# EAGLE design Volterra Doughter Board MKS GEN L 2.1 (EAGLE 9.6.2)
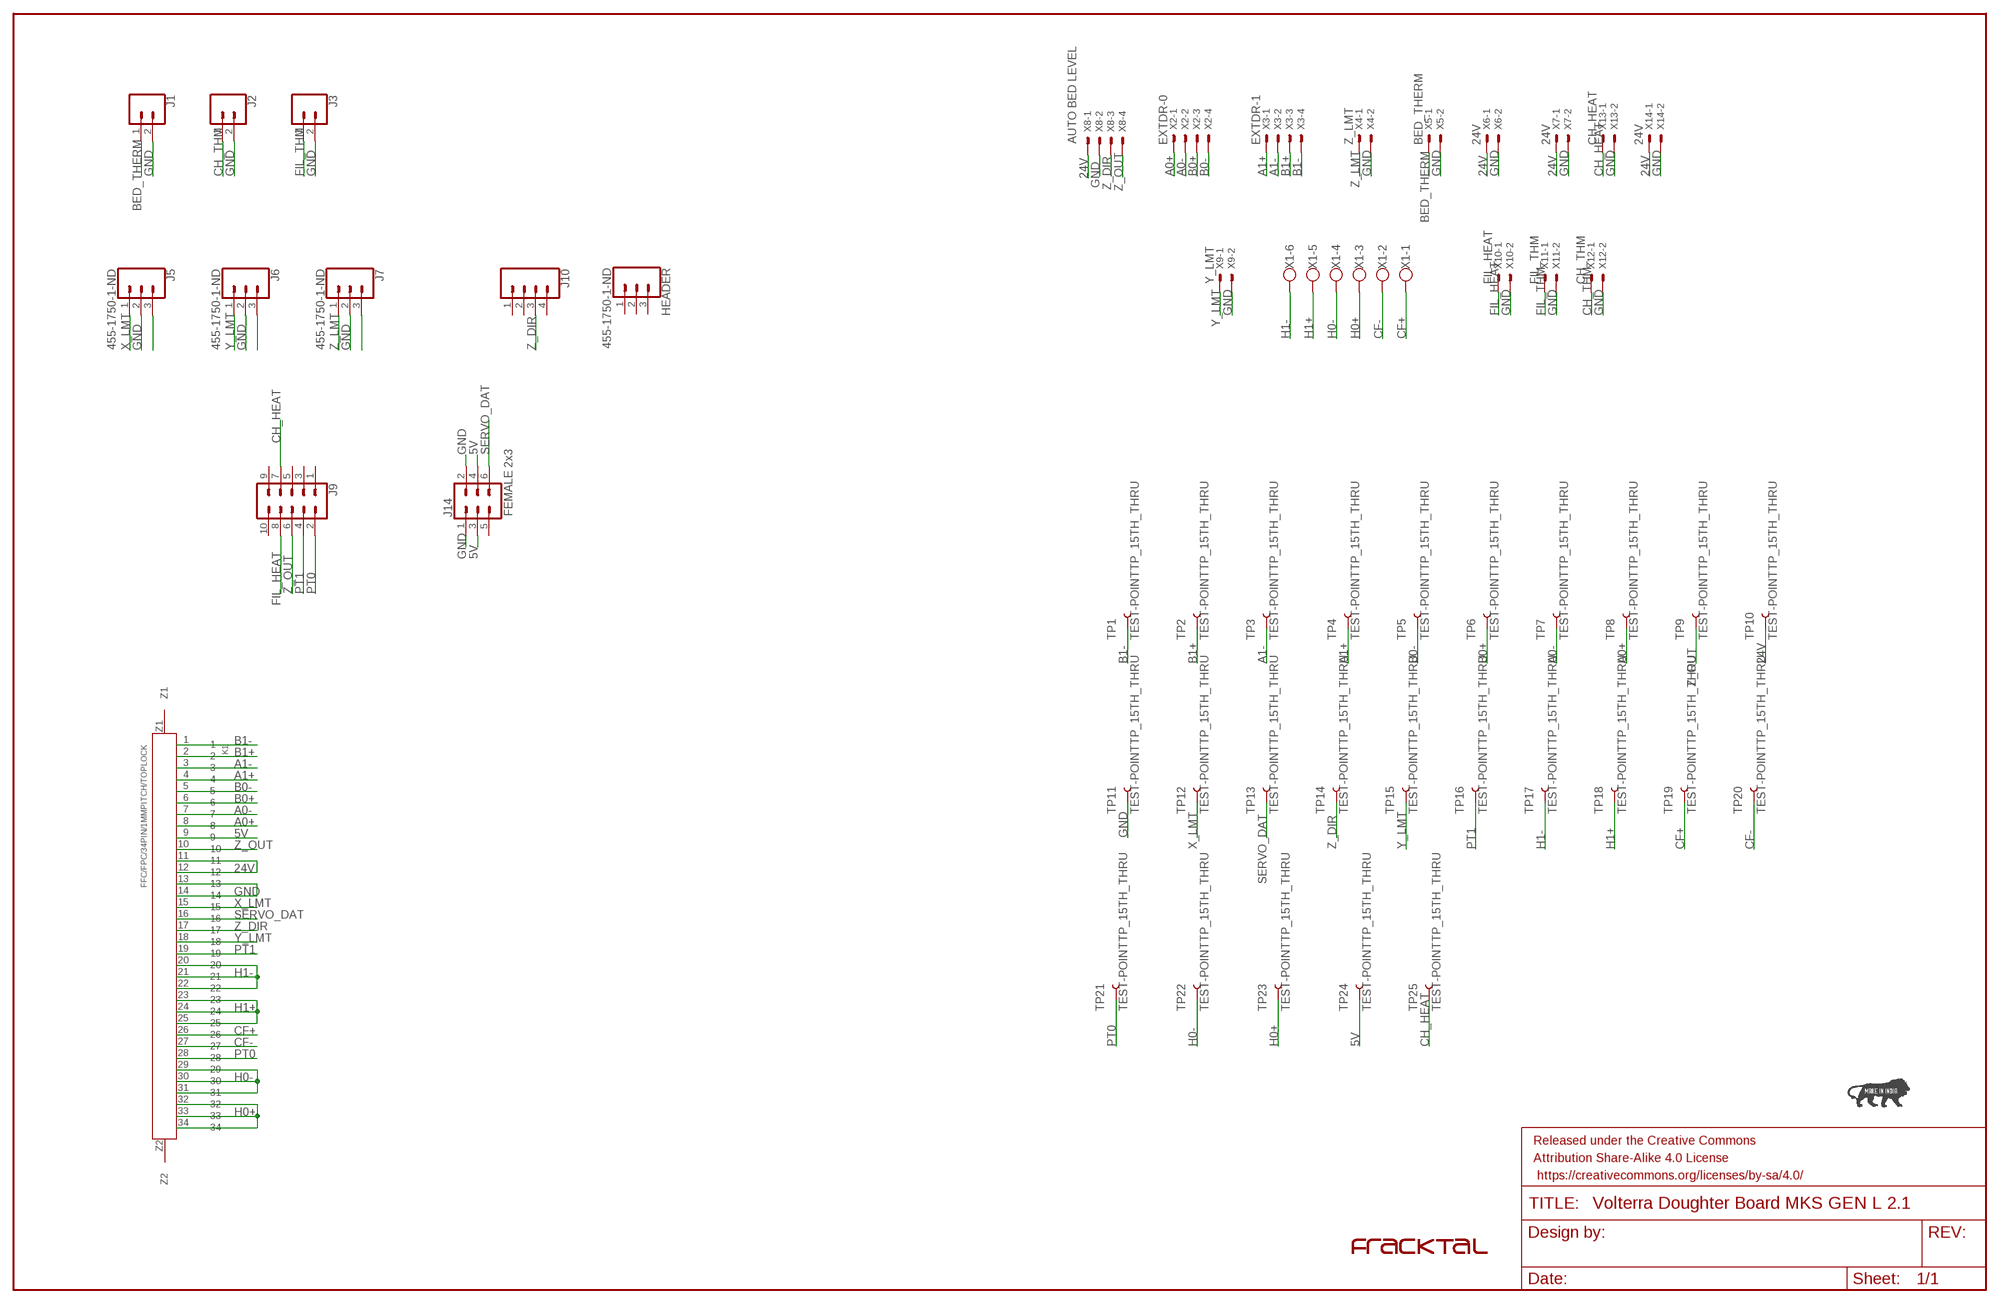
[diagram p0: schematic, sheet 1]

## Parts
FRAME1  FRAME-LEDGER  [CREATIVE_COMMONS]
HEADER  455-1750-1-ND  CONN_03  [1X03]
J1  CONN_02  [1X02]
J2  CONN_02  [1X02]
J3  CONN_02  [1X02]
J5  455-1750-1-ND  CONN_03  [1X03]
J6  455-1750-1-ND  CONN_03  [1X03]
J7  455-1750-1-ND  CONN_03  [1X03]
J9  CONN_05X2PTH  [2X5]
J10  CONN_04  [1X04]
J14  FEMALE 2x3  CONN_03X2FEMALE  [2X3]
K1  FFC/FPC/34PIN/1MMPITCH/TOPLOCK  [34PIN/1MMPITCH/FFC/FPC]
TP1  TEST-POINTTP_15TH_THRU  [TP_15TH]
TP2  TEST-POINTTP_15TH_THRU  [TP_15TH]
TP3  TEST-POINTTP_15TH_THRU  [TP_15TH]
TP4  TEST-POINTTP_15TH_THRU  [TP_15TH]
TP5  TEST-POINTTP_15TH_THRU  [TP_15TH]
TP6  TEST-POINTTP_15TH_THRU  [TP_15TH]
TP7  TEST-POINTTP_15TH_THRU  [TP_15TH]
TP8  TEST-POINTTP_15TH_THRU  [TP_15TH]
TP9  TEST-POINTTP_15TH_THRU  [TP_15TH]
TP10  TEST-POINTTP_15TH_THRU  [TP_15TH]
TP11  TEST-POINTTP_15TH_THRU  [TP_15TH]
TP12  TEST-POINTTP_15TH_THRU  [TP_15TH]
TP13  TEST-POINTTP_15TH_THRU  [TP_15TH]
TP14  TEST-POINTTP_15TH_THRU  [TP_15TH]
TP15  TEST-POINTTP_15TH_THRU  [TP_15TH]
TP16  TEST-POINTTP_15TH_THRU  [TP_15TH]
TP17  TEST-POINTTP_15TH_THRU  [TP_15TH]
TP18  TEST-POINTTP_15TH_THRU  [TP_15TH]
TP19  TEST-POINTTP_15TH_THRU  [TP_15TH]
TP20  TEST-POINTTP_15TH_THRU  [TP_15TH]
TP21  TEST-POINTTP_15TH_THRU  [TP_15TH]
TP22  TEST-POINTTP_15TH_THRU  [TP_15TH]
TP23  TEST-POINTTP_15TH_THRU  [TP_15TH]
TP24  TEST-POINTTP_15TH_THRU  [TP_15TH]
TP25  TEST-POINTTP_15TH_THRU  [TP_15TH]
U$1  FRACKTALLOGO  [FRACKTALLOGO]
U$2  MAKEININDIA  [MAKEININDIA]
X1  W237-6  [W237-6]
X2  EXTDR-0  JST-XH-04-PIN-LONG-PAD  [JST-XH-04-PACKAGE-LONG-PAD]
X3  EXTDR-1  JST-XH-04-PIN-LONG-PAD  [JST-XH-04-PACKAGE-LONG-PAD]
X4  Z_LMT  JST-XH-02-PIN-LONG-PAD  [JST-XH-02-PACKAGE-LONG-PAD]
X5  BED_THERM  JST-XH-02-PIN-LONG-PAD  [JST-XH-02-PACKAGE-LONG-PAD]
X6  24V  JST-XH-02-PIN-LONG-PAD  [JST-XH-02-PACKAGE-LONG-PAD]
X7  24V  JST-XH-02-PIN-LONG-PAD  [JST-XH-02-PACKAGE-LONG-PAD]
X8  AUTO BED LEVELING  JST-XH-04-PIN-LONG-PAD  [JST-XH-04-PACKAGE-LONG-PAD]
X9  Y_LMT  JST-XH-02-PIN-LONG-PAD  [JST-XH-02-PACKAGE-LONG-PAD]
X10  FIL_HEAT  JST-XH-02-PIN-LONG-PAD  [JST-XH-02-PACKAGE-LONG-PAD]
X11  FIL_THM  JST-XH-02-PIN-LONG-PAD  [JST-XH-02-PACKAGE-LONG-PAD]
X12  CH_THM  JST-XH-02-PIN-LONG-PAD  [JST-XH-02-PACKAGE-LONG-PAD]
X13  CH_HEAT  JST-XH-02-PIN-LONG-PAD  [JST-XH-02-PACKAGE-LONG-PAD]
X14  24V  JST-XH-02-PIN-LONG-PAD  [JST-XH-02-PACKAGE-LONG-PAD]

## Nets
5V: J14.3 J14.4 K1.9 TP24.P$1
24V: K1.11 K1.12 TP10.P$1 X6.1 X7.1 X8.1 X14.1
A0+: K1.8 TP8.P$1 X2.1
A0-: K1.7 TP7.P$1 X2.2
A1+: K1.4 TP4.P$1 X3.1
A1-: K1.3 TP3.P$1 X3.2
B0+: K1.6 TP6.P$1 X2.3
B0-: K1.5 TP5.P$1 X2.4
B1+: K1.2 TP2.P$1 X3.3
B1-: K1.1 TP1.P$1 X3.4
BED_THERM: J1.1 X5.1
CF+: K1.26 TP19.P$1 X1.1
CF-: K1.27 TP20.P$1 X1.2
CH_HEAT: J9.7 TP25.P$1 X13.1
CH_THM: J2.1 X12.1
FIL_HEAT: J9.8 X10.1
FIL_THM: J3.1 X11.1
GND: J1.2 J2.2 J3.2 J5.2 J6.2 J7.2 J14.1 J14.2 K1.13 K1.14 TP11.P$1 X4.2 X5.2 X6.2 X7.2 X8.2 X9.2 X10.2 X11.2 X12.2 X13.2 X14.2
H0+: K1.32 K1.33 K1.34 TP23.P$1 X1.3
H0-: K1.29 K1.30 K1.31 TP22.P$1 X1.4
H1+: K1.23 K1.24 K1.25 TP18.P$1 X1.5
H1-: K1.20 K1.21 K1.22 TP17.P$1 X1.6
N$3: J5.3
N$6: J6.3
N$10: J7.3
PT0: J9.2 K1.28 TP21.P$1
PT1: J9.4 K1.19 TP16.P$1
SERVO_DAT: J14.6 K1.16 TP13.P$1
X_LMT: J5.1 K1.15 TP12.P$1
Y_LMT: J6.1 K1.18 TP15.P$1 X9.1
Z_DIR: J10.3 K1.17 TP14.P$1 X8.3
Z_LMT: J7.1 X4.1
Z_OUT: J9.6 K1.10 TP9.P$1 X8.4
Unconnected: HEADER.1 HEADER.2 HEADER.3 J9.1 J9.3 J9.5 J9.9 J9.10 J10.1 J10.2 J10.4 J14.5 K1.Z1 K1.Z2

## Library data of the parts
FRAME1 = SparkFun-Aesthetics:FRAME-LEDGER: Schematic Frame - Ledger Standard 11x14 US Ledger frame
HEADER J5-J7 = SparkFun-Connectors:CONN_03: Multi connection point. Often used as Generic Header-pin footprint for 0.1 inch spaced/style header connections On any of the 0.1 inch spaced packages, you can populate with these: Break Away Headers - Straight <https://www.sparkfun.com/products/116> (PRT-00116) Break Away Male Headers - Right Angle <https://www.sparkfun.com/products/553> (PRT-00553) Female Headers <https://www.sparkfun.com/products/115> (PRT-00115) Break Away Headers - Machine Pin <https://www.sparkfun.com/products/117> (PRT-00117) Break Away Female Headers - Swiss Machine Pin <https://www.sparkfun.com/products/743> (PRT-00743) Stackable Header - 3 Pin (Female, 0.1") <https://www.sparkfun.com/products/13875> (PRT-13875) For SCREWTERMINALS and SPRING TERMINALS visit here: Screw Terimnals on SparkFun.com <https://www.sparkfun.com/search/results?term=Screw+Terminals> (5mm/3.5mm/2.54mm spacing) This device is also useful as a general connection point to wire up your design to another part of your project. Our various solder wires solder well into these plated through hole pads. Hook-Up Wire - Assortment (Stranded, 22 AWG) <https://www.sparkfun.com/products/11375> (PRT-11375) Hook-Up Wire - Assortment (Solid Core, 22 AWG) <https://www.sparkfun.com/products/11367> (PRT-11367) View the entire wire category on our website here <https://www.sparkfun.com/categories/141> Special notes: Molex polarized connector foot print use with SKU : PRT-08232 with associated crimp pins and housings.; PROD_ID: XXX-00000
J1-J3 = SparkFun-Connectors:CONN_02: Multi connection point. Often used as Generic Header-pin footprint for 0.1 inch spaced/style header connections On any of the 0.1 inch spaced packages, you can populate with these: Break Away Headers - Straight <https://www.sparkfun.com/products/116> (PRT-00116) Break Away Male Headers - Right Angle <https://www.sparkfun.com/products/553> (PRT-00553) Female Headers <https://www.sparkfun.com/products/115> (PRT-00115) Break Away Headers - Machine Pin <https://www.sparkfun.com/products/117> (PRT-00117) Break Away Female Headers - Swiss Machine Pin <https://www.sparkfun.com/products/743> (PRT-00743) For SCREWTERMINALS and SPRING TERMINALS visit here: Screw Terimnals on SparkFun.com <https://www.sparkfun.com/search/results?term=Screw+Terminals> (5mm/3.5mm/2.54mm spacing) This device is also useful as a general connection point to wire up your design to another part of your project. Our various solder wires solder well into these plated through hole pads. Hook-Up Wire - Assortment (Stranded, 22 AWG) <https://www.sparkfun.com/products/11375> (PRT-11375) Hook-Up Wire - Assortment (Solid Core, 22 AWG) <https://www.sparkfun.com/products/11367> (PRT-11367) View the entire wire category on our website here <https://www.sparkfun.com/categories/141> Special notes: Molex polarized connector foot print use with: PRT-08233 with associated crimp pins and housings. 2.54_SCREWTERM for use with PRT-10571. 3.5mm Screw Terminal footprints for PRT-08084 5mm Screw Terminal footprints for use with PRT-08432
J9 = SparkFun-Connectors:CONN_05X2: Multi connection point. Often used as Generic Header-pin footprint for 0.1 inch spaced/style header connections For AVR SPI programming port, see special device with nice symbol: "AVR_SPI_PROG_5x2.dev" You can populate with any combo of single row headers, but if you'd like an exact match, check these: 2x5 AVR ICSP Male Header <https://www.sparkfun.com/products/778> (PRT-00778) 2x5 Pin Shrouded Header <https://www.sparkfun.com/products/8506> (PRT-08506) On any of the 0.1 inch spaced packages, you can populate with these: Break Away Headers - Straight <https://www.sparkfun.com/products/116> (PRT-00116) Break Away Male Headers - Right Angle <https://www.sparkfun.com/products/553> (PRT-00553) Female Headers <https://www.sparkfun.com/products/115> (PRT-00115) Break Away Headers - Machine Pin <https://www.sparkfun.com/products/117> (PRT-00117) Break Away Female Headers - Swiss Machine Pin <https://www.sparkfun.com/products/743> (PRT-00743) Special note: the shrouded connector mates well with our 5x2 ribbon cables: 2x5 Pin IDC Ribbon Cable <https://www.sparkfun.com/products/8535> (PRT-08535); PROD_ID: CONN-08499; SF_ID: PRT-0778
J10 = SparkFun-Connectors:CONN_04: Multi connection point. Often used as Generic Header-pin footprint for 0.1 inch spaced/style header connections On any of the 0.1 inch spaced packages, you can populate with these: Break Away Headers - Straight <https://www.sparkfun.com/products/116> (PRT-00116) Break Away Male Headers - Right Angle <https://www.sparkfun.com/products/553> (PRT-00553) Female Headers <https://www.sparkfun.com/products/115> (PRT-00115) Break Away Headers - Machine Pin <https://www.sparkfun.com/products/117> (PRT-00117) Break Away Female Headers - Swiss Machine Pin <https://www.sparkfun.com/products/743> (PRT-00743) For SCREWTERMINALS and SPRING TERMINALS visit here: Screw Terimnals on SparkFun.com <https://www.sparkfun.com/search/results?term=Screw+Terminals> (5mm/3.5mm/2.54mm spacing) This device is also useful as a general connection point to wire up your design to another part of your project. Our various solder wires solder well into these plated through hole pads. Hook-Up Wire - Assortment (Stranded, 22 AWG) <https://www.sparkfun.com/products/11375> (PRT-11375) Hook-Up Wire - Assortment (Solid Core, 22 AWG) <https://www.sparkfun.com/products/11367> (PRT-11367) View the entire wire category on our website here <https://www.sparkfun.com/categories/141> Special notes: Molex polarized connector foot print use with SKU : PRT-08231 with associated crimp pins and housings. 1MM SMD Version SKU: PRT-10208; PROD_ID: CONN-09696
J14 = SparkFun-Connectors:CONN_03X2: Multi connection point. Often used as Generic Header-pin footprint for 0.1 inch spaced/style header connections You can populate with any combo of single row headers, but if you'd like an exact match, check these: Header - 2x3 (Male, 0.1") <https://www.sparkfun.com/products/12807> (PRT-12807) Header - 2x3 (Female, 0.1") <https://www.sparkfun.com/products/13010> (PRT-13010) 2x3 Pin Shrouded Header <https://www.sparkfun.com/products/10877> (PRT-10877) On any of the 0.1 inch spaced packages, you can populate with these: Break Away Headers - Straight <https://www.sparkfun.com/products/116> (PRT-00116) Break Away Male Headers - Right Angle <https://www.sparkfun.com/products/553> (PRT-00553) Female Headers <https://www.sparkfun.com/products/115> (PRT-00115) Break Away Headers - Machine Pin <https://www.sparkfun.com/products/117> (PRT-00117) Break Away Female Headers - Swiss Machine Pin <https://www.sparkfun.com/products/743> (PRT-00743) Special note: the shrouded connector mates well with our 3x2 ribbon cables: Ribbon Crimp Connector - 6-pin (2x3, Female) <https://www.sparkfun.com/products/10651> (PRT-10651) Ribbon Cable - 6 wire (15ft) <https://www.sparkfun.com/products/10646> (PRT-10646); PROD_ID: CONN-11566
K1 = FracktalWorks_Eagle_Library:FFC/FPC/34PIN/1MMPITCH/TOPLOCK
TP1-TP25 = SparkFun-Connectors:TEST-POINT: SparkFun Test Points Bare copper test points for troubleshooting or In-Circuit-Testing. These are used by our Production team for verifying production board runs using pogo-pins on test beds. SparkFun Products: SparkFun LSM9DS1 Breakout <https://www.sparkfun.com/products/13284> SparkFun PSOC <https://www.sparkfun.com/products/13714> SparkFun Load Cell Amplifier <https://www.sparkfun.com/products/13879>
U$1 = FracktalWorks_Eagle_Library:FRACKTALLOGO
U$2 = FracktalWorks_Eagle_Library:MAKEININDIA
X1 = con-wago-500:W237-6: WAGO SCREW CLAMP; OC_FARNELL: unknown; OC_NEWARK: unknown
X2 X3 = Rembrandt Electronics - JST XH Connectors v1-0:JST-XH-04-PIN: JST XH Connector 2 Pin Wire to board connector. Pitch: 2,54 mm, (0.100") Number of pins: 4 Created by Rembrandt Electronics www.rembrandtelectronics.com
X4-X7 X9-X14 = Rembrandt Electronics - JST XH Connectors v1-0:JST-XH-02-PIN: JST XH Connector 2 Pin Wire to board connector. Pitch: 2,54 mm, (0.100") Number of pins: 2 Created by Rembrandt Electronics www.rembrandtelectronics.com
X8 = Rembrandt Electronics - JST XH Connectors v1-0:JST-XH-04-PIN: JST XH Connector 2 Pin Wire to board connector. Pitch: 2,54 mm, (0.100") Number of pins: 4 Created by Rembrandt Electronics www.rembrandtelectronics.com; AUTOBEDLEVL: AUTO BED LEVEL

## Board
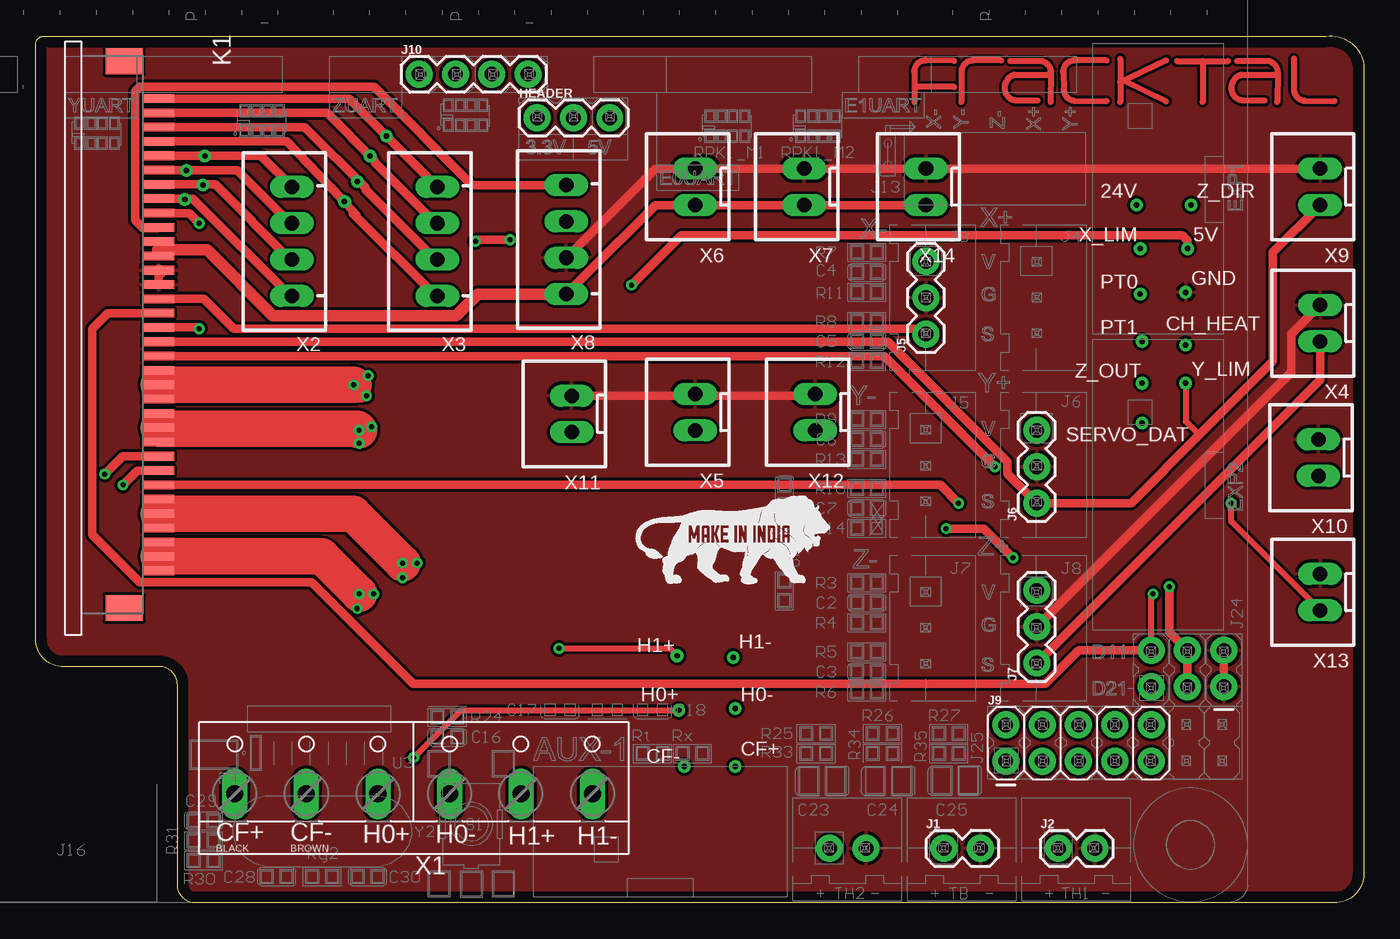
[diagram p1: board, top side]
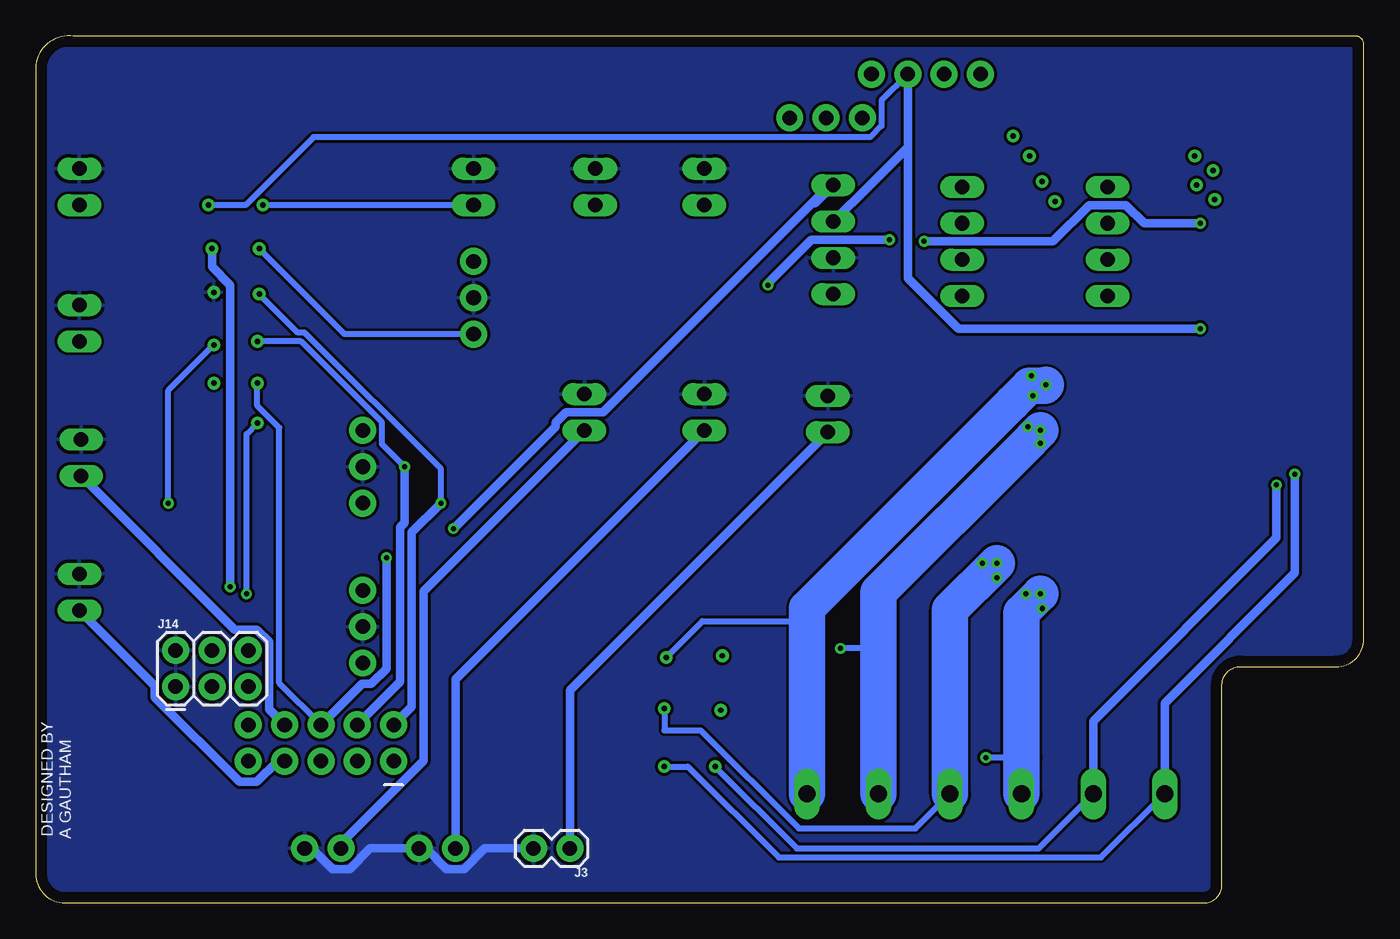
[diagram p2: board, bottom side, seen from below]

Size 92.84 x 60.6 mm. Coordinates in mm from the lower left corner, seen from the top.
Outline: 90.81,0 11.18,0 arc-90 9.91,1.27 9.91,15.24 arc90 8.64,16.51 1.91,16.51 arc-90 0,18.41 0,60.07 arc-90 0.64,60.58 90.2,60.58 arc-90 92.84,58.58 92.84,2.03 arc-90 90.81,0
Copper layers (1*16): Top 0.035mm / dielectric 1.5mm / Bottom 0.035mm
Design rules "LionCircuits": minimum track width 8mil, minimum drill 0.35mm, track to track 8mil, track to pad 8mil, pad to pad 8mil, via to via 8mil, smd to smd 8mil, copper to edge 30mil, drill to drill 10mil, minimum pad ring 10mil, minimum via ring 8mil, stop-mask expansion 4mil, vias tented up to drill 0mil, thermal gap 10mil

### Footprints (pad centres in the part's own frame; a part is rotated, then mirrored left to right if it is on the bottom)
1X03 = drill 1.016 pad 1.88: 1 0,0; 2 2.54,0; 3 5.08,0
1X02 = drill 1.016 pad 1.88: 1 0,0; 2 2.54,0
2X5 = drill 1.016 pad 1.88: 1 0,0; 2 0,2.54; 3 2.54,0; 4 2.54,2.54; 5 5.08,0; 6 5.08,2.54; 7 7.62,0; 8 7.62,2.54; 9 10.16,0; 10 10.16,2.54
1X04 = drill 1.016 pad 1.88: 1 0,0; 2 2.54,0; 3 5.08,0; 4 7.62,0
2X3 = drill 1.016 pad 1.88: 1 0,0; 2 0,2.54; 3 2.54,0; 4 2.54,2.54; 5 5.08,0; 6 5.08,2.54
34PIN/1MMPITCH/FFC/FPC = smd 0.6 x 2.2: 1 -14.43,2.1; 2 -13.43,2.1; 3 -12.43,2.1; 4 -11.43,2.1; 5 -10.43,2.1; 6 -9.43,2.1; 7 -8.43,2.1; 8 -7.43,2.1; 9 -6.43,2.1; 10 -5.43,2.1; 11 -4.43,2.1; 12 -3.43,2.1; 13 -2.43,2.1; 14 -1.43,2.1; 15 -0.43,2.1; 16 0.57,2.1; 17 1.57,2.1; 18 2.57,2.1; 19 3.57,2.1; 20 4.57,2.1; 21 5.57,2.1; 22 6.57,2.1; 23 7.57,2.1; 24 8.57,2.1; 25 9.57,2.1; 26 10.57,2.1; 27 11.57,2.1; 28 12.57,2.1; 29 13.57,2.1; 30 14.57,2.1; 31 15.57,2.1; 32 16.57,2.1; 33 17.57,2.1; 34 18.57,2.1 | smd 1.8 x 2.6: Z1 -17.03,-0.3; Z2 21.17,-0.3
TP_15TH = drill 0.381 pad 0.61: P$1 0,0
W237-6 = drill 1.194 long: 1 -12.5,-1.27; 2 -7.5,-1.27; 3 -2.5,-1.27; 4 2.5,-1.27; 5 7.5,-1.27; 6 12.5,-1.27
JST-XH-04-PACKAGE-LONG-PAD = drill 1.016 long: 1 -3.81,0; 2 -1.27,0; 3 1.27,0; 4 3.81,0
JST-XH-02-PACKAGE-LONG-PAD = drill 1.016 long: 1 -1.27,0; 2 1.27,0

### Placement (x,y rotation side)
FRAME1  16.26,-13.97 0 top  (outside the outline)
HEADER  35.05,54.86 0 top
J1  63.5,3.81 0 top
J2  71.5,3.81 0 top
J3  55.5,3.81 180 bottom
J5  62.23,39.75 90 top
J6  69.98,27.94 90 top
J7  69.98,16.76 90 top
J9  67.82,9.91 0 top
J10  26.8,57.91 0 top
J14  83.06,15.11 0 bottom
K1  6.48,41.78 270 top
TP1  24.51,53.59 0 top
TP2  23.37,52.2 0 bottom
TP3  22.48,50.42 0 top
TP4  21.59,49.02 0 top
TP5  11.81,52.2 0 top
TP6  10.54,51.18 0 top
TP7  11.68,50.16 0 top
TP8  10.41,49.15 0 top
TP9  77.34,36.32 0 top
TP10  76.96,48.77 0 top
TP11  80.39,42.67 0 top
TP12  77.22,45.72 0 top
TP13  77.34,33.53 0 top
TP14  80.77,48.77 0 top
TP15  80.39,36.32 0 top
TP16  77.34,39.24 0 top
TP17  48.77,17.14 0 top
TP18  44.83,17.27 0 top
TP19  48.9,9.53 0 top
TP20  45.34,9.53 0 top
TP21  77.22,42.55 0 top
TP22  48.9,13.59 0 top
TP23  44.96,13.46 0 top
TP24  80.52,45.72 0 top
TP25  80.39,38.99 0 top
U$1  73.41,55.88 0 top
U$2  42.93,21.59 0 top
X1  26.42,8.89 0 top
X2  17.91,46.23 90 top
X3  28.07,46.23 90 top
X4  89.79,40.51 90 top
X5  46.1,34.29 90 top
X6  46.1,50.04 90 top
X7  53.72,50.04 90 top
X8  37.08,46.35 90 top
X9  89.79,50.04 90 top
X10  89.66,31.11 90 top
X11  37.47,34.16 90 top
X12  54.48,34.29 90 top
X13  89.79,21.72 90 top
X14  62.23,50.04 90 top

### Tracks (layer width: path | path; a pad name or v marks a point on that pad's centre or on a via)
5V  (via drill 0.35)
  Top 0.61: J14.3 J14.4 79.25,18.92 v79.25,22.1 | K1.9 10,48.21 10.02,48.2 10.73,48.2 v11.43,47.5 | v33.15,46.35 30.86,46.35 v30.73,46.23 | TP24.P$1 80.52,46.3 80.15,46.67 45.15,46.67 v41.66,43.18
  Bottom 0.61: v11.43,47.5 15.35,47.5 16.62,48.77 19.19,48.77 21.74,46.23 v30.73,46.23 | v33.15,46.35 38.61,46.35 41.66,43.31 v41.66,43.18 | TP24.P$1 80.52,44.45 79.25,43.18 v79.25,22.1
24V
  Top 0.61: X8.1 38.35,43.81 38.37,43.81 43.33,48.77 X6.1 X7.1 X14.1 | K1.11 K1.12 8.52,45.27 8.52,45.63
  Top 0.813: X8.1 30.9,42.55 29.4,41.05 16.58,41.05 11.99,45.63 8.52,45.63
  Bottom 0.406: X14.1 TP10.P$1
A0+
  Top 0.406: 11.05,49.15 TP8.P$1 8.64,49.15 K1.8
  Top 0.61: K1.8 10.99,49.21 17.78,42.42 X2.1
A0-
  Top 0.406: TP7.P$1 11.73,50.21 12.45,50.21
  Top 0.61: K1.7 12.45,50.21 12.53,50.21 17.78,44.96 X2.2
A1+
  Top 0.406: TP4.P$1 21.59,48.9 22.16,48.32 22.42,48.07
  Top 0.61: K1.4 17.53,53.21 21.4,49.21 22.42,48.07 | 22.16,48.32 22.16,48.2 27.94,42.42 X3.1
A1-
  Top 0.406: TP3.P$1 22.61,50.42 23.05,49.97
  Top 0.61: K1.3 18.81,54.21 23.05,49.97 23.05,49.85 27.94,44.96 X3.2
B0+
  Top 0.406: TP6.P$1 10.57,51.21 11.18,51.21
  Top 0.61: K1.6 11.18,51.21 14.07,51.21 17.78,47.5 X2.3
B0-
  Top 0.406: TP5.P$1 11.83,52.21 12.45,52.21
  Top 0.61: K1.5 12.45,52.21 15.73,52.21 X2.4
B1+
  Top 0.406: TP2.P$1 23.69,51.88
  Top 0.61: K1.2 20.35,55.21 23.69,51.88 23.69,51.75 27.94,47.5 X3.3
B1-
  Top 0.406: TP1.P$1 24.96,53.15
  Top 0.61: K1.1 21.89,56.21 24.96,53.15 X3.4
BED_THERM
  Bottom 0.61: X5.1 63.5,15.62 J1.1
CF+  (via drill 0.35)
  Top 0.61: v4.83,29.97 6.07,31.21 K1.26
  Bottom 0.406: X1.1 18.36,3.17 40.89,3.17 47.24,9.53 TP19.P$1
  Bottom 0.61: X1.1 13.92,13.97 4.83,23.06 v4.83,29.97
CF-  (via drill 0.35)
  Top 0.61: v6.1,29.21 7.1,30.21 K1.27
  Bottom 0.406: X1.2 22.73,3.81 39.62,3.81 TP20.P$1
  Bottom 0.61: X1.2 18.92,12.7 6.1,25.52 v6.1,29.21
CH_HEAT  (via drill 0.35)
  Top 0.406: X13.1 83.57,26.67 v83.57,27.94
  Bottom 0.406: v83.57,27.94 83.57,35.81 TP25.P$1
  Bottom 0.61: X13.1 84.51,15.16 84.51,14.39 78.58,8.46 77.38,8.46 75.93,9.91 J9.7
CH_THM
  Bottom 0.61: X12.1 65.73,21.77 65.73,9.94 71.5,4.18 J2.1
FIL_HEAT
  Bottom 0.61: J9.8 76.53,13.54 76.53,18.25 77.38,19.1 78.92,19.1 X10.1
FIL_THM
  Bottom 0.61: X11.1 55.5,14.86 J3.1
GND
  Top 0.61: J14.2 J14.1 | 73.48,3.81 J2.2 | K1.13 K1.14 | X8.2 38.35,46.35 38.37,46.35 43.33,51.31 X6.2 X7.2 X14.2 X9.2 | J7.2 87.76,37.08 87.76,39.77 88.5,40.51 88.52,40.51 X4.2 | X11.2 45.97,35.43 | 45.97,35.43 X5.2 | X12.2 54.36,35.43 45.97,35.43
  Top 0.813: K1.13 8.72,44.07
  Bottom 0.61: J3.2 61.45,3.81 62.9,2.36 64.1,2.36 65.55,3.81 J1.2 69.45,3.81 70.9,2.36 72.1,2.36 73.55,3.81 J2.2
  pour Top: 0.51,60.58 90.55,60.58 arc-90 92.84,58.29 92.84,2.16 arc-90 90.68,0 11.18,0 arc-90 9.91,1.27 9.91,15.24 arc90 8.64,16.51 1.78,16.51 arc-90 0,18.29 0,59.82 0,60.07 arc-90
  pour Top: 0.64,60.58 90.81,60.58 arc-90 92.84,58.55 92.84,2.03 arc-90 90.81,0 11.18,0 arc-90 9.91,1.27 9.91,15.24 arc90 8.64,16.51 2.03,16.51 arc-90 0,18.54 0,59.94 arc-90
  pour Bottom: 0.51,60.58 90.81,60.58 arc-90 92.84,58.55 92.84,1.91 arc-90 90.93,0 11.3,0 arc-90 9.91,1.4 9.91,15.24 arc90 8.64,16.51 2.03,16.51 arc-90 0,18.54 0,60.07 arc-90
  pour Top: 0.64,60.58 90.17,60.58 arc-90 92.84,57.91 92.84,2.03 arc-90 90.81,0 11.3,0 arc-90 9.91,1.4 9.91,15.37 arc90 8.76,16.51 2.03,16.51 arc-90 0,18.54 0,60.07 arc-90 0.51,60.58
H0+  (via drill 0.35)
  Top 0.406: K1.32 20,25.21 v23.62,21.59 | K1.34 19.84,23.21 v22.48,20.57 | v26.42,10.16 29.72,13.46 TP23.P$1
  Top 2.54: v22.61,21.59 19.98,24.21 K1.33
  Bottom 0.406: 24.64,19.94 24.64,20.57 v23.62,21.59 v22.61,21.59 22.48,21.46 v22.48,20.57 22.61,20.45 22.61,20.32 | 23.92,10.16 v26.42,10.16
  Bottom 2.54: X1.3 23.92,10.16 23.92,20.28 v22.61,21.59
H0-  (via drill 0.35)
  Top 0.406: K1.29 22.21,28.21 v26.67,23.75 | K1.31 22.17,26.21 v25.65,22.73
  Top 2.54: v25.65,23.75 22.19,27.21 K1.30
  Bottom 0.406: 27.69,22.86 26.8,23.75 v26.67,23.75 v25.65,23.75 v25.65,22.73 26.42,21.97 26.42,21.59 | X1.4 31.33,5.21 39.5,5.21 46.36,12.06 48.9,12.06 TP22.P$1
  Bottom 2.54: X1.4 28.92,20.49 v25.65,23.75
H1+  (via drill 0.35)
  Top 0.406: K1.23 22.56,34.21 v23.5,33.27 22.86,33.27 v22.61,33.02 | K1.25 22.52,32.21 v22.61,32.13 22.48,32.26 22.48,33.15 | v36.58,17.78 44.32,17.78 TP18.P$1
  Top 2.54: K1.24 8.64,33.15 22.48,33.15 v22.61,33.02
  Bottom 0.406: 33.92,17.78 v36.58,17.78
  Bottom 2.54: v22.61,33.02 23.88,31.75 33.92,21.71 33.92,17.78 X1.5
H1-  (via drill 0.35)
  Top 0.406: v23.24,36.83 8.96,36.83 K1.20 K1.21 K1.22 22.89,35.21 v23.11,35.43
  Top 2.54: K1.21 22.21,36.21 v22.22,36.2
  Bottom 0.406: TP17.P$1 46.23,19.68 39.69,19.68 24.55,34.83 24.55,34.96
  Bottom 2.54: v22.22,36.2 22.28,36.14 23.36,36.14 24.55,34.96 38.92,20.59 X1.6
PT0  (via drill 0.35)
  Top 0.61: K1.28 63.24,29.21 v64.52,27.94
  Bottom 0.406: TP21.P$1 74.52,39.85 74.04,39.85 64.52,30.32 v64.52,27.94
  Bottom 0.61: v64.52,27.94 66.55,25.91 66.55,13.72 J9.2
PT1  (via drill 0.35)
  Top 0.61: K1.19 59.32,38.21 v67.06,30.48
  Bottom 0.406: v67.06,30.48 68.63,32.05 68.63,33.58 74.3,39.24 TP16.P$1
  Bottom 0.61: v67.06,30.48 67.06,26.55 67.36,26.25 67.36,15.44 J9.4
SERVO_DAT  (via drill 0.35)
  Top 0.406: J14.6 77.98,21.46 v78.11,21.59
  Top 0.61: J14.6 72.91,17.65 70.58,15.32 26.36,15.32 19.28,22.41 7.27,22.41 3.94,25.73 3.94,40.13 5.02,41.21 K1.16
  Bottom 0.406: v78.11,21.59 78.11,32.77 TP13.P$1
X_LMT
  Top 0.61: J5.1 61.85,40.13 13.82,40.13 11.74,42.21 K1.15
  Bottom 0.406: J5.1 71.25,39.75 TP12.P$1
Y_LMT
  Top 0.406: TP15.P$1 80.39,33.66 81.34,32.7
  Top 0.61: K1.18 59.58,39.21 67.94,30.85 67.94,29.98 J6.1 76.58,27.94 81.34,32.7 86.49,37.85 86.49,45.47 X9.1
Z_DIR  (via drill 0.35)
  Top 0.61: K1.17 11.35,40.21 v11.43,40.13
  Bottom 0.406: J10.3 33.71,56.08 33.71,54.31 34.49,53.52 73.42,53.52 78.17,48.77 TP14.P$1
  Bottom 0.61: X8.3 35.81,48.9 35.8,48.9 31.88,52.81 J10.3 31.88,43.67 28.34,40.13 v11.43,40.13
Z_LMT
  Top 0.61: X4.1 89.79,36.58 J7.1
Z_OUT  (via drill 0.35)
  Top 0.61: v63.64,26.16 66.29,26.16 v68.33,24.13 | X8.4 30.5,50.16 23.64,57.03 7.27,57.03 6.97,56.72 6.97,47.7 7.52,47.15 8.51,47.15 K1.10
  Bottom 0.406: J9.6 75.82,15.37 75.82,33.21 77.34,34.73 TP9.P$1
  Bottom 0.61: J9.6 70.03,15.32 69.38,15.32 68.33,16.37 v68.33,24.13 | 38.37,48.9 38.35,48.9 X8.4 37.32,50.16 53.2,34.29 55.77,34.29 56.52,33.55 56.52,33.29 v63.64,26.16

### Text on the board
tNames: 24V | Z_DIR | X_LIM | 5V | PT0 | GND | PT1 | CH_HEAT | Z_OUT | Y_LIM | SERVO_DAT | H1+ | H1- | H0+ | H0- | CF- | CF+ | BLACK | CF+ | BROWN | CF- | H0+ | H0- | H1+ | H1-
bNames: DESIGNED BY | A GAUTHAM